# Altium schematic sheet power.SchDoc
size A4
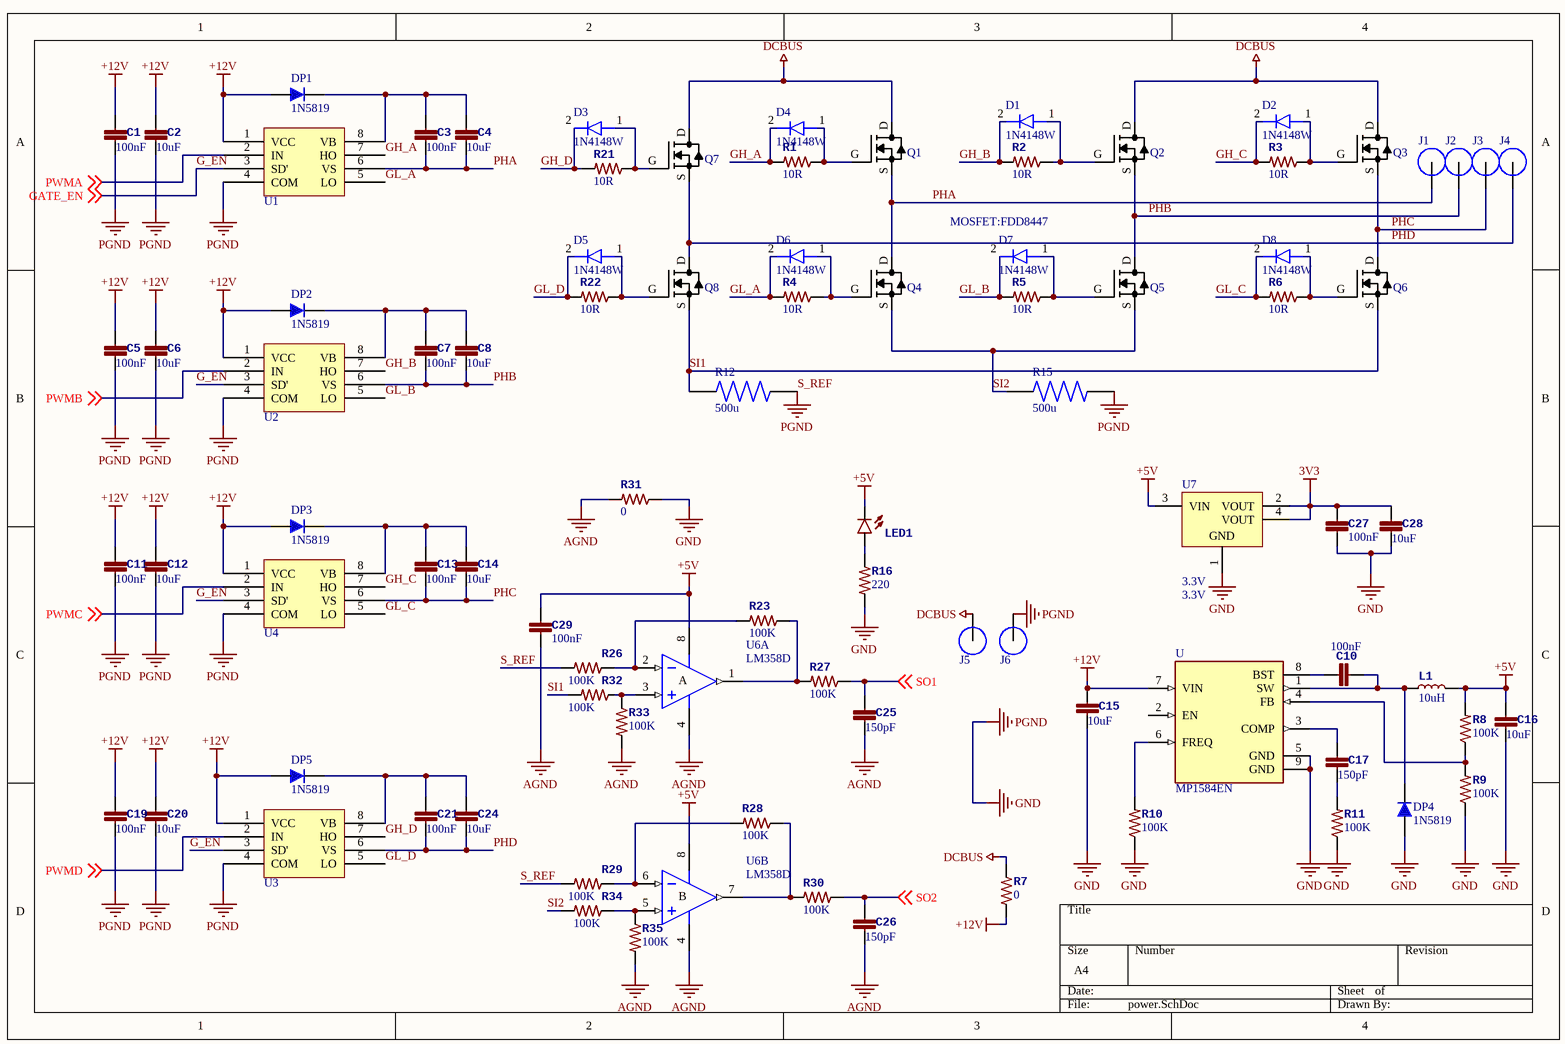
[diagram p0: power.SchDoc]

## Parts
C1  value 100nF  [_1206]  (hidden comment: Cap)
C2  value 10uF  [_1206]  (hidden comment: Cap)
C3  value 100nF  [_1206]  (hidden comment: Cap)
C4  value 10uF  [_1206]  (hidden comment: Cap)
C5  value 100nF  [_1206]  (hidden comment: Cap)
C6  value 10uF  [_1206]  (hidden comment: Cap)
C7  value 100nF  [_1206]  (hidden comment: Cap)
C8  value 10uF  [_1206]  (hidden comment: Cap)
C10  value 100nF  [_0805]  (hidden comment: Cap)
C11  value 100nF  [_1206]  (hidden comment: Cap)
C12  value 10uF  [_1206]  (hidden comment: Cap)
C13  value 100nF  [_1206]  (hidden comment: Cap)
C14  value 10uF  [_1206]  (hidden comment: Cap)
C15  value 10uF  [_1206]  (hidden comment: Cap)
C16  value 10uF  [_1206]  (hidden comment: Cap)
C17  value 150pF  [_0805]  (hidden comment: Cap)
C19  value 100nF  [_1206]  (hidden comment: Cap)
C20  value 10uF  [_1206]  (hidden comment: Cap)
C21  value 100nF  [_1206]  (hidden comment: Cap)
C24  value 10uF  [_1206]  (hidden comment: Cap)
C25  value 150pF  [_0805]  (hidden comment: Cap)
C26  value 150pF  [_0805]  (hidden comment: Cap)
C27  value 100nF  [_0805]  (hidden comment: Cap)
C28  value 10uF  [_1206]  (hidden comment: Cap)
C29  value 100nF  [_0805]  (hidden comment: Cap)
D1  1N4148W  [SOD523F]
D2  1N4148W  [SOD523F]
D3  1N4148W  [SOD523F]
D4  1N4148W  [SOD523F]
D5  1N4148W  [SOD523F]
D6  1N4148W  [SOD523F]
D7  1N4148W  [SOD523F]
D8  1N4148W  [SOD523F]
DP1  1N5819  [430X270D]
DP2  1N5819  [430X270D]
DP3  1N5819  [430X270D]
DP4  1N5819  [430X270D]
DP5  1N5819  [430X270D]
J1  (no value)  [M3 Spade Hole]
J2  (no value)  [M3 Spade Hole]
J3  (no value)  [M3 Spade Hole]
J4  (no value)  [M3 Spade Hole]
J5  (no value)  [M3 Spade Hole]
J6  (no value)  [M3 Spade Hole]
L1  value 10uH  [_INDUCTOR-SMD-6.0mm]  (hidden comment: Inductor)
LED1  LED  [_LED-0805]  (value not drawn)
Q1  FILL_FOOTPRINT  [TO229P994X240-3N]  (value not drawn)
Q2  FILL_FOOTPRINT  [TO229P994X240-3N]  (value not drawn)
Q3  FILL_FOOTPRINT  [TO229P994X240-3N]  (value not drawn)
Q4  FILL_FOOTPRINT  [TO229P994X240-3N]  (value not drawn)
Q5  FILL_FOOTPRINT  [TO229P994X240-3N]  (value not drawn)
Q6  FILL_FOOTPRINT  [TO229P994X240-3N]  (value not drawn)
Q7  FILL_FOOTPRINT  [TO229P994X240-3N]  (value not drawn)
Q8  FILL_FOOTPRINT  [TO229P994X240-3N]  (value not drawn)
R1  value 10R  [_0805]  (hidden comment: Resistor)
R2  value 10R  [_0805]  (hidden comment: Resistor)
R3  value 10R  [_0805]  (hidden comment: Resistor)
R4  value 10R  [_0805]  (hidden comment: Resistor)
R5  value 10R  [_0805]  (hidden comment: Resistor)
R6  value 10R  [_0805]  (hidden comment: Resistor)
R7  value 0  [_1206]  (hidden comment: Resistor)
R8  value 100K  [_0805]  (hidden comment: Resistor)
R9  value 100K  [_0805]  (hidden comment: Resistor)
R10  value 100K  [_0805]  (hidden comment: Resistor)
R11  value 100K  [_0805]  (hidden comment: Resistor)
R12  500u  [RESC6332X64N]
R15  500u  [RESC6332X64N]
R16  value 220  [_0805]  (hidden comment: Resistor)
R21  value 10R  [_0805]  (hidden comment: Resistor)
R22  value 10R  [_0805]  (hidden comment: Resistor)
R23  value 100K  [_0805]  (hidden comment: Resistor)
R26  value 100K  [_0805]  (hidden comment: Resistor)
R27  value 100K  [_0805]  (hidden comment: Resistor)
R28  value 100K  [_0805]  (hidden comment: Resistor)
R29  value 100K  [_0805]  (hidden comment: Resistor)
R30  value 100K  [_0805]  (hidden comment: Resistor)
R31  value 0  [_0805]  (hidden comment: Resistor)
R32  value 100K  [_0805]  (hidden comment: Resistor)
R33  value 100K  [_0805]  (hidden comment: Resistor)
R34  value 100K  [_0805]  (hidden comment: Resistor)
R35  value 100K  [_0805]  (hidden comment: Resistor)
U  MP1584EN  [SOIC127P600X170-9N]
U1  IR2104  [_SO08]  (value not drawn)
U2  IR2104  [_SO08]  (value not drawn)
U3  IR2104  [_SO08]  (value not drawn)
U4  IR2104  [_SO08]  (value not drawn)
U6  LM358D  [D008_L]  (parts A,B of 2)
U7  3.3V  [_SOT223]

## Nets
3V3: C27.2 C28.1 U7.2(VOUT) U7.4(VOUT)
+5V: C16.1 C29.2 L1.2 LED1.K R8.2 U6.8(V+) U7.3(VIN)
+12V: C1.1 C2.1 C5.1 C6.1 C11.1 C12.1 C15.1 C19.1 C20.1 DP1.1 DP2.1 DP3.1 DP5.1 R7.2 U.7(VIN) U1.1(VCC) U2.1(VCC) U3.1(VCC) U4.1(VCC)
AGND: C25.2 C26.2 C29.1 R31.2 R33.2 R35.2 U6.4(V-)
DCBUS: J5.1 Q1.D Q2.D Q3.D Q7.D R7.1
S_REF: C1.2 C2.2 C5.2 C6.2 C11.2 C12.2 C15.2 C16.2 C19.2 C20.2 C27.1 C28.2 DP4.1 J6.1 R9.1 R10.1 R11.1 R12.1 R15.1 R16.2 R26.2 R29.2 R31.1 U.5(GND) U.9(GND) U1.4(COM) U2.4(COM) U3.4(COM) U4.4(COM) U7.1(GND)  [also labelled GND, PGND]
G_EN: U1.3(SD') U2.3(SD') U3.3(SD') U4.3(SD') ; off-sheet GATE_EN  [also labelled GATE_EN]
GH_A: D4.2(C1) R1.2 U1.7(HO)
GH_B: D1.2(C1) R2.2 U2.7(HO)
GH_C: D2.2(C1) R3.2 U4.7(HO)
GH_D: D3.2(C1) R21.2 U3.7(HO)
GL_A: D6.2(C1) R4.2 U1.5(LO)
GL_B: D7.2(C1) R5.2 U2.5(LO)
GL_C: D8.2(C1) R6.2 U4.5(LO)
GL_D: D5.2(C1) R22.2 U3.5(LO)
PHA: C3.2 C4.2 J1.1 Q1.S Q4.D U1.6(VS)
PHB: C7.2 C8.2 J2.1 Q2.S Q5.D U2.6(VS)
PHC: C13.2 C14.2 J3.1 Q3.S Q6.D U4.6(VS)
PHD: C21.2 C24.2 J4.1 Q7.S Q8.D U3.6(VS)
PWMA: U1.2(IN) ; off-sheet PWMA
PWMB: U2.2(IN) ; off-sheet PWMB
PWMC: U4.2(IN) ; off-sheet PWMC
PWMD: U3.2(IN) ; off-sheet PWMD
SI1: Q6.S Q8.S R12.2 R32.2
SI2: Q4.S Q5.S R15.2 R34.2
SO1: C25.1 R27.1 ; off-sheet SO1
SO2: C26.1 R30.1 ; off-sheet SO2
NetC3_1: C3.1 C4.1 DP1.2 U1.8(VB)
NetC7_1: C7.1 C8.1 DP2.2 U2.8(VB)
NetC10_1: C10.1 U.8(BST)
NetC10_2: C10.2 DP4.2 L1.1 U.1(SW)
NetC13_1: C13.1 C14.1 DP3.2 U4.8(VB)
NetC17_1: C17.1 U.3(COMP)
NetC17_2: C17.2 R11.2
NetC21_1: C21.1 C24.1 DP5.2 U3.8(VB)
NetD1_1: D1.1(A1) Q2.G R2.1
NetD2_1: D2.1(A1) Q3.G R3.1
NetD3_1: D3.1(A1) Q7.G R21.1
NetD4_1: D4.1(A1) Q1.G R1.1
NetD5_1: D5.1(A1) Q8.G R22.1
NetD6_1: D6.1(A1) Q4.G R4.1
NetD7_1: D7.1(A1) Q5.G R5.1
NetD8_1: D8.1(A1) Q6.G R6.1
NetLED1_A: LED1.A R16.1
NetR8_1: R8.1 R9.2 U.4(FB)
NetR10_2: R10.2 U.6(FREQ)
NetR23_1: R23.1 R27.2 U6.1(OUT)
NetR23_2: R23.2 R26.1 U6.2(IN-)
NetR28_1: R28.1 R30.2 U6.7(OUT)
NetR28_2: R28.2 R29.1 U6.6(IN-)
NetR32_1: R32.1 R33.1 U6.3(IN+)
NetR34_1: R34.1 R35.1 U6.5(IN+)

Not connected (* = marked no-connect by the designer): U 2(EN)

## Notes on the sheet
- (near D7) MOSFET:FDD8447
- (in symbol LM358D, part A) A
- (in symbol LM358D, part B) B

## Library data of the parts
C1-C8 C10-C17 C19-C21 C24-C29 = Cap_1
D1-D8 = 1N4148W: DIODE, HIGH SPEED, SOD-123F; Diode Type:Small Signal; Voltage, Vrrm:75V; Current, If AV:10mA; Voltage, Vf Max:1V; Temperature, Tj Max:150Â°C; Termination Type:SMD; Case Style:SOD-123F; No. of Pins:2; Current, If Vf:100mA; Current, Ifrm:300mA; Current, Ifs Max:2A; Power, Ptot:400mW; Temperature, Tj Min:-65Â°C; Time, trr Max:4ns; MF: Micro Commercial; MP: 1N4148W; Price: None; Availability: In Stock; Package: SOD-123 Multicomp; SnapEDA_Link: https://www.snapeda.com/parts/1N4148W/Micro%20Commercial/view-part/134617/?ref=snap; Check_prices: https://www.snapeda.com/parts/1N4148W/Micro%20Commercial/view-part/134617/?ref=eda; Value: *
DP1-DP5 = 1N5819: Schottkey Rectifiers; Designer: Abbas Basereh; Data: 16-12-2016; Link: *; Part. No: *
J1-J6 = M3 Spade Terminal
LED1 = LED: PROD_ID: DIO-09955
Q1-Q8 = NTMFS4935NT1G: MOSFET N-CH 30V 13A SO8FL; Manufacturer: ON Semiconductor; FET Type: N-Channel; Current - Continuous Drain (Id) @ 25°C: 13A (Ta), 93A (Tc); Drive Voltage (Max Rds On,  Min Rds On): 4.5V, 10V; Vgs(th) (Max) @ Id: 2.2V @ 250µA; Gate Charge (Qg) (Max) @ Vgs: 49.4nC @ 10V; Input Capacitance (Ciss) (Max) @ Vds: 4850pF @ 15V; Vgs (Max): ±20V; Power Dissipation (Max): 930mW (Ta), 48W (Tc); Rds On (Max) @ Id, Vgs: 3.2 mOhm @ 30A, 10V; Supplier 1: Digi-Key; Supplier Part Number 1: NTMFS4935NT1GOSCT-ND; RoHS: RoHS Compliant; Category: Discrete Semiconductor Products; Stock 1: 932; Pricing 1: 1=0.61, 10=0.541, 100=0.4145, 500=0.3277 (USD); Packaging: Cut Tape (CT); Part Status: Active; Technology: MOSFET (Metal Oxide); Drain to Source Voltage (Vdss): 30V; FET Feature: -; Operating Temperature: -55°C ~ 150°C (TJ); Mounting Type: Surface Mount; Supplier Device Package: 5-DFN (5x6) (8-SOFL); Package / Case: 8-PowerTDFN, 5 Leads; ComponentLink1URL: http://www.onsemi.com/pub_link/Collateral/NTMFS4935N-D.PDF; ComponentLink1Description: http://www.onsemi.com/pub_link/Collateral/NTMFS4935N-D.PDF; Manufacturer Part Number: NTMFS4935NT1G
R12 R15 = Y162820K0000D0W: Package: None; Price: None; Value: *; MP: Y162820K0000D0W; Availability: Unavailable
U = MP1584EN: Buck Switching Regulator IC Positive Adjustable 0.8V 1 Output 3A 8-SOIC _0.154, 3.90mm Width_ Exposed Pad; MF: Monolithic Power; MP: MP1584EN; Value: *; Package: SOIC-8 Monolithic Power; SnapEDA_Link: https://www.snapeda.com/parts/MP1584EN/Monolithic%20Power%20Systems%20Inc./view-part/891721/?ref=snap; Price: None; Availability: Unavailable
U6 = LM358D: Dual Operational Amplifier; Published: 16-Jan-2001; LatestRevisionDate: 13-Apr-2006; LatestRevisionNote: IPC-7351 Footprint Added.; DatasheetVersion: Jul-1998; PackageVersion: Jan-1998; PackageReference: D008; Publisher: Altium Limited; PackageDescription: 8-Pin Small Outline Integrated Circuit 1.27 mm Pitch; Code_IPC: SOIC127P600-8; ComponentLink1Description: Manufacturer Link; ComponentLink1URL: http://www.ti.com/; ComponentLink2Description: Datasheet; ComponentLink2URL: http://www-s.ti.com/sc/ds/lm358.pdf
U7 = LD1117: Value: 3.3V